# Altium schematic sheet FrontEndSheet.SchDoc
size 203 x 152 mm
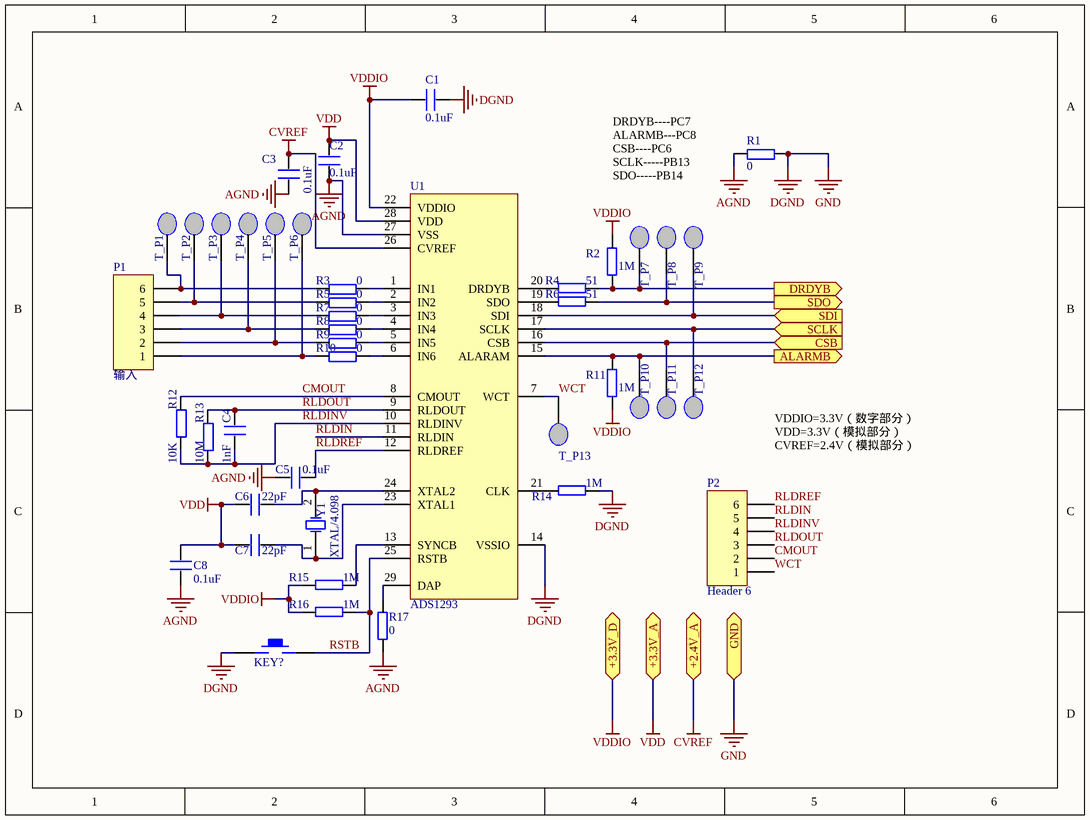
[diagram p0: FrontEndSheet.SchDoc]

## Parts
C1  0.1uF  [0805]
C2  0.1uF  [0805]
C3  0.1uF  [0805]
C4  1nF  [0603]
C5  0.1uF  [0805]
C6  22pF  [0805]
C7  22pF  [0805]
C8  0.1uF  [0805]
KEY?  KEY_M  [KEY_M]  (value not drawn)
P1  输入  [HDR1X6]
P2  Header 6  [HDR1X6]
R1  0  [0805]
R2  1M  [0805]
R3  0  [0805]
R4  51  [0805]
R5  0  [0805]
R6  51  [0805]
R7  0  [0805]
R8  0  [0805]
R9  0  [0805]
R10  0  [0805]
R11  1M  [0805]
R12  10K  [0805]
R13  10M  [0805]
R14  1M  [0805]
R15  1M  [0805]
R16  1M  [0805]
R17  0  [0805]
T_P1  Test_Pad  [PCB_Test_Pad]  (value not drawn)
T_P2  Test_Pad  [PCB_Test_Pad]  (value not drawn)
T_P3  Test_Pad  [PCB_Test_Pad]  (value not drawn)
T_P4  Test_Pad  [PCB_Test_Pad]  (value not drawn)
T_P5  Test_Pad  [PCB_Test_Pad]  (value not drawn)
T_P6  Test_Pad  [PCB_Test_Pad]  (value not drawn)
T_P7  Test_Pad  [PCB_Test_Pad]  (value not drawn)
T_P8  Test_Pad  [PCB_Test_Pad]  (value not drawn)
T_P9  Test_Pad  [PCB_Test_Pad]  (value not drawn)
T_P10  Test_Pad  [PCB_Test_Pad]  (value not drawn)
T_P11  Test_Pad  [PCB_Test_Pad]  (value not drawn)
T_P12  Test_Pad  [PCB_Test_Pad]  (value not drawn)
T_P13  Test_Pad  [PCB_Test_Pad]  (value not drawn)
U1  ADS1293  [SQA28A]
Y1  XTAL/4.098  [XTAL_US]

## Ports
+2.4V_A, +3.3V_A, +3.3V_D, ALARMB (out), CSB (in), DRDYB (out), GND, SCLK (in), SDI (in), SDO (out)

## Nets
AGND: C2.1 C3.1 C5.2 C8.1 R1.1 R17.2 U1.27(VSS)
CVREF: C3.2 U1.26(CVREF) ; port +2.4V_A
DGND: C1.2 KEY?.1 R1.2 R14.1 U1.14(VSSIO) ; port GND  [also labelled GND]
VDD: C2.2 C6.1 C7.1 C8.2 U1.28(VDD) ; port +3.3V_A
VDDIO: C1.1 R2.1 R11.2 R15.2 R16.2 U1.22(VDDIO) ; port +3.3V_D
ALARMB: R11.1 T_P10.1 U1.15(ALARAM) ; port ALARMB
CMOUT: P2.2 R12.2 U1.8(CMOUT)
CSB: T_P11.1 U1.16(CSB) ; port CSB
DRDYB: R2.2 R4.1 T_P7.1 ; port DRDYB
RLDIN: P2.5 U1.11(RLDIN)
RLDINV: C4.2 P2.4 R12.1 R13.1 U1.10(RLDINV)
RLDOUT: C4.1 P2.3 R13.2 U1.9(RLDOUT)
RLDREF: C5.1 P2.6 U1.12(RLDREF)
RSTB: KEY?.2 R16.1 U1.25(RSTB)
SCLK: T_P12.1 U1.17(SCLK) ; port SCLK
SDI: T_P9.1 U1.18(SDI) ; port SDI
SDO: R6.1 T_P8.1 ; port SDO
WCT: P2.1 T_P13.1 U1.7(WCT)
NetC6_2: C6.2 U1.24(XTAL2) Y1.2(OSC2)
NetC7_2: C7.2 U1.23(XTAL1) Y1.1(OSC1)
NetP1_1: P1.1 R10.1 T_P6.1
NetP1_2: P1.2 R9.1 T_P5.1
NetP1_3: P1.3 R8.1 T_P4.1
NetP1_4: P1.4 R7.1 T_P3.1
NetP1_5: P1.5 R5.1 T_P2.1
NetP1_6: P1.6 R3.1 T_P1.1
NetR3_2: R3.2 U1.1(IN1)
NetR4_2: R4.2 U1.20(DRDYB)
NetR5_2: R5.2 U1.2(IN2)
NetR6_2: R6.2 U1.19(SDO)
NetR7_2: R7.2 U1.3(IN3)
NetR8_2: R8.2 U1.4(IN4)
NetR9_2: R9.2 U1.5(IN5)
NetR10_2: R10.2 U1.6(IN6)
NetR14_2: R14.2 U1.21(CLK)
NetR15_1: R15.1 U1.13(SYNCB)
NetR17_1: R17.1 U1.29(DAP)

## Notes on the sheet
- (near R1) DRDYB----PC7
  ALARMB---PC8
  CSB----PC6
  SCLK-----PB13
  SDO-----PB14
  SDI----PB15
- VDDIO=3.3V（数字部分）
  VDD=3.3V（模拟部分）
  CVREF=2.4V（模拟部分）

## Library data of the parts
C1-C8 = C
P1 P2 = Header 6: Header, 6-Pin; LatestRevisionDate: 17-Jul-2002; LatestRevisionNote: Re-released for DXP Platform.; Publisher: Altium Limited
R1-R17 = R
Y1 = XTAL: Crystal Oscillator; Published: 8-Jun-2000; LatestRevisionDate: 17-Jul-2002; LatestRevisionNote: Re-released for DXP Platform.; PackageReference: R38; Publisher: Altium Limited; PackageDescription: Crystal, Thru-Hole; 2 Leads; Body 3.1 x 8.2 mm (Dia.xH)